# EasyEDA Pro project ProPrj_rp-nano-4_2025-11-21.epro

# Schematic Schematic1
Board Name: Board1; Create Date: 2025-11-17; Page Name: P1; Project Name: rp-nano-4; Schematic Name: Schematic1; Update Date: 2025-11-18; Company: EasyEDA.com; Page Size: A4; Version: V1.0
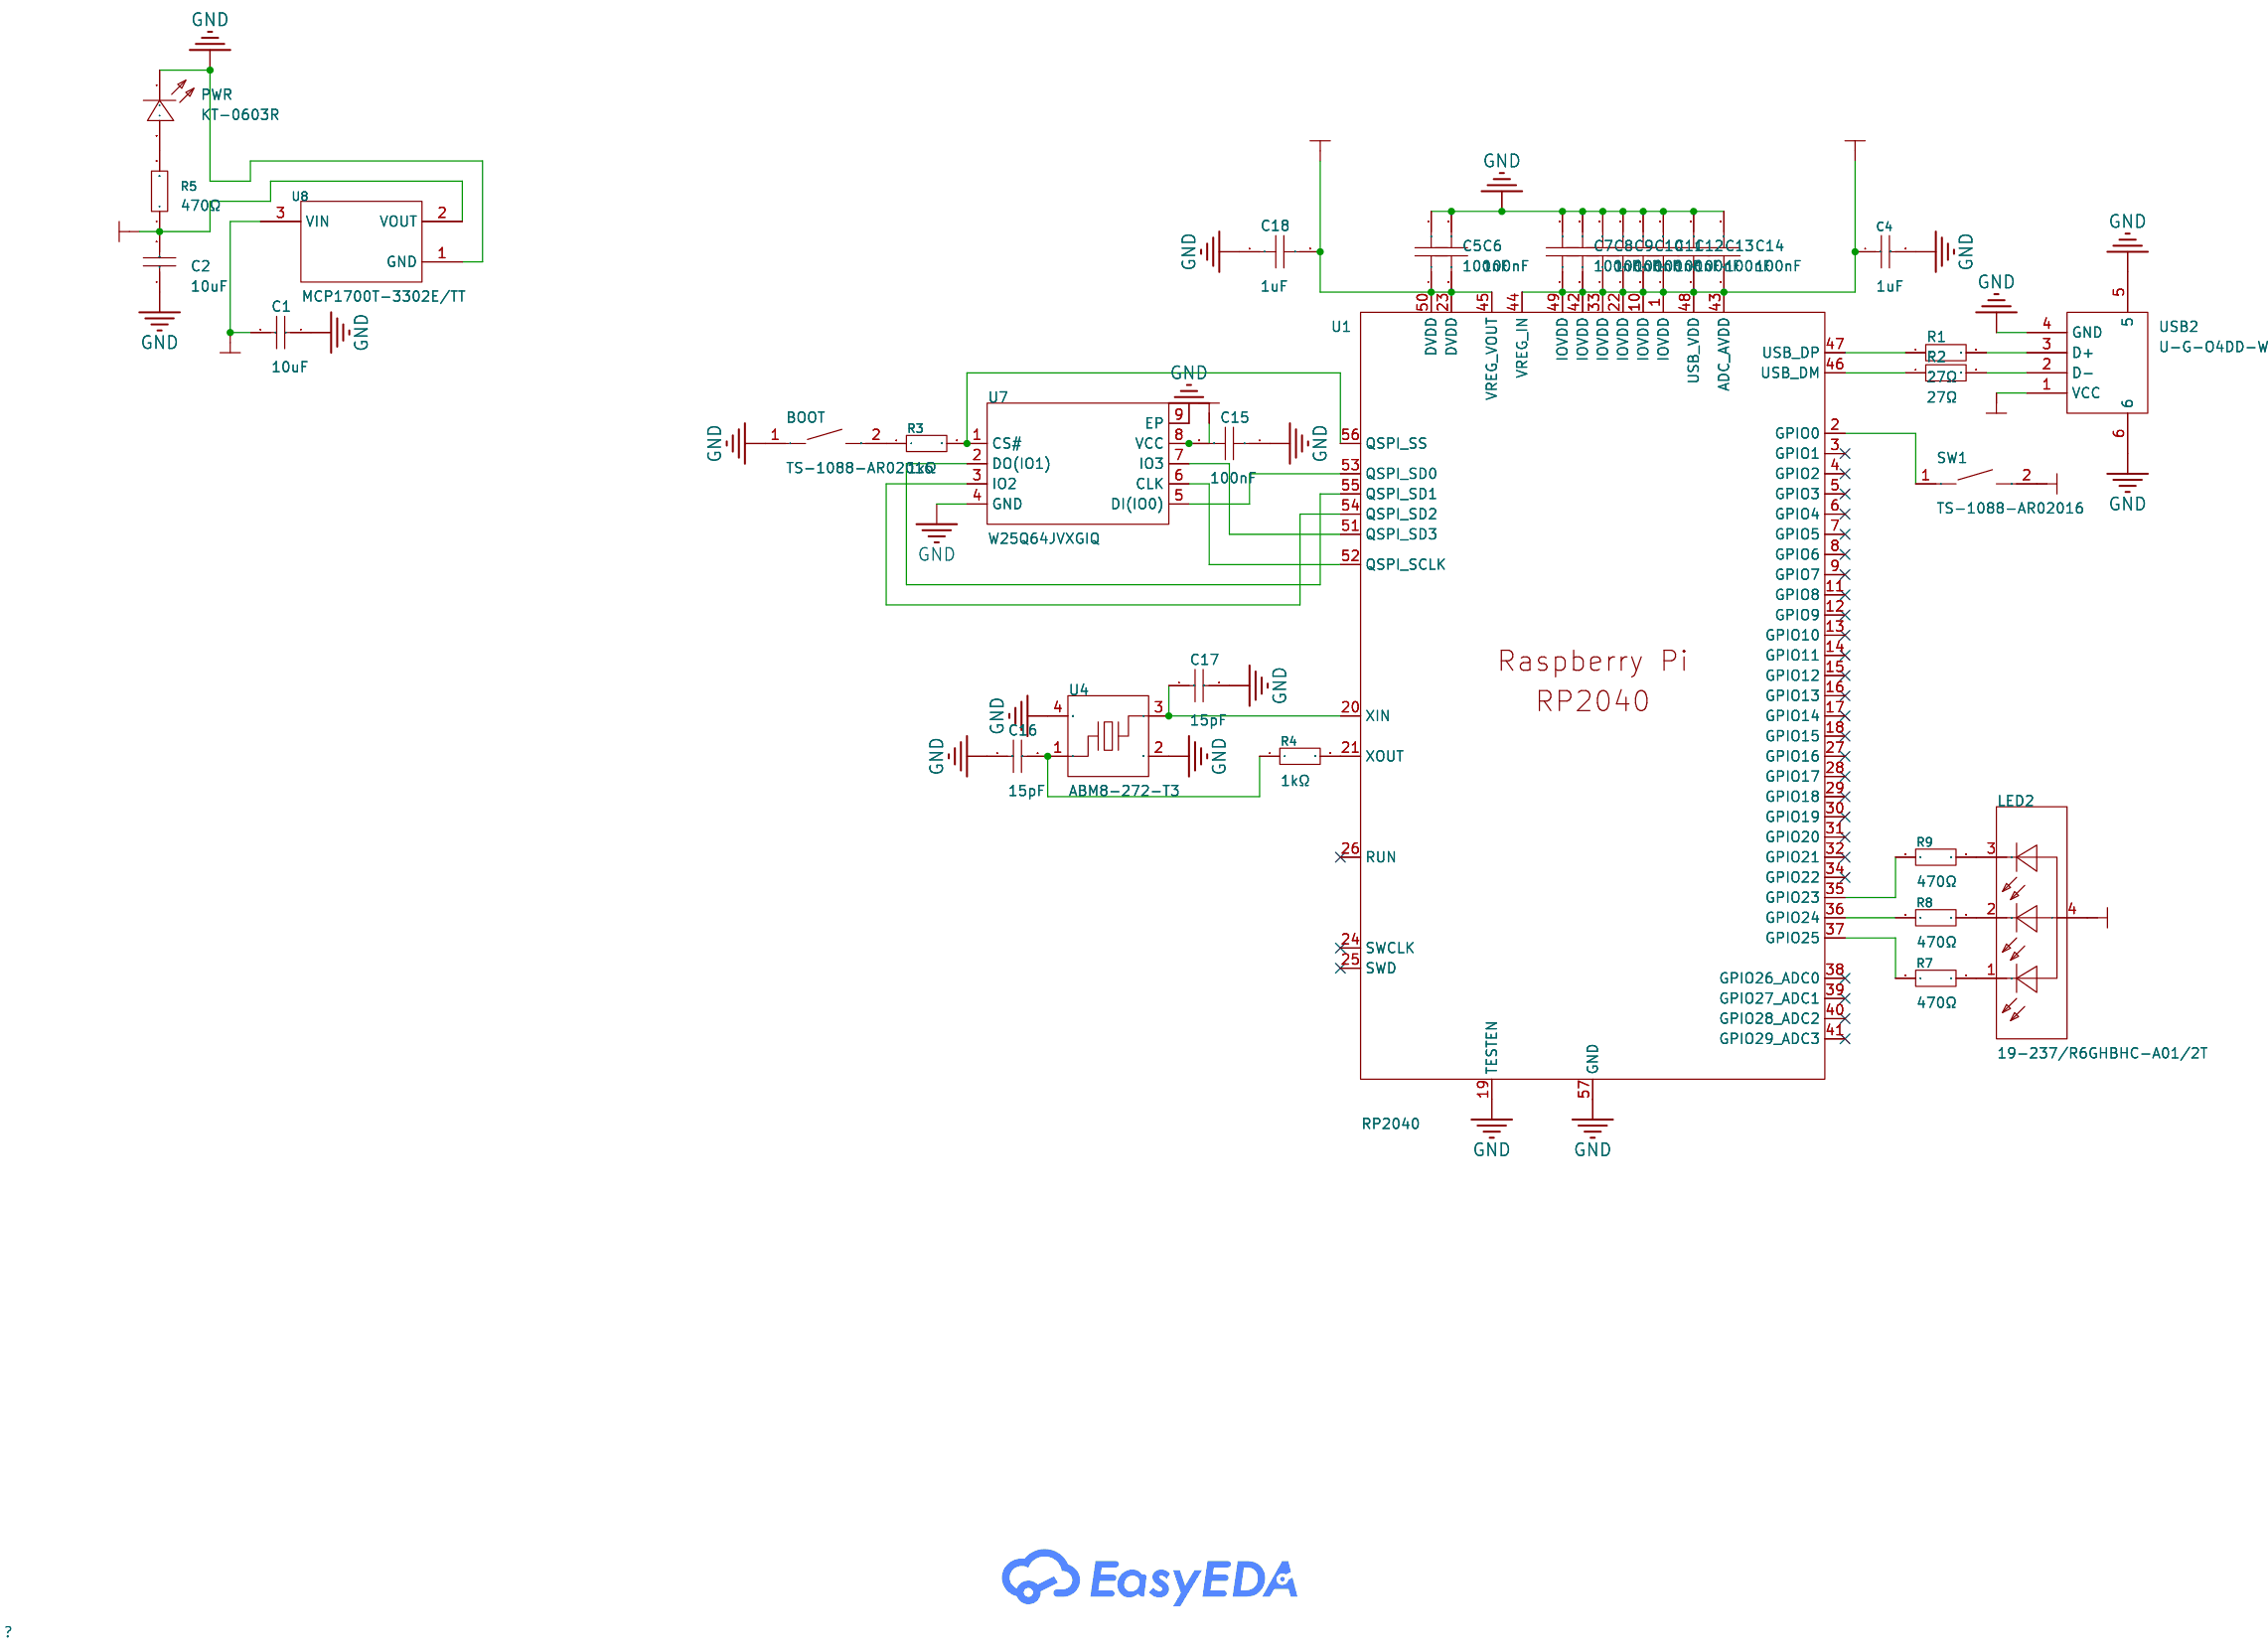
[diagram p0: schematic sheet]

## Parts
BOOT  TS-1088-AR02016  [SW-SMD_L3.9-W3.0-P4.45]
C1  10uF  [C0402]
C2  10uF  [C0402]
C4  1uF  [C0402]
C5  100nF  [C0402]
C6  100nF  [C0402]
C7  100nF  [C0402]
C8  100nF  [C0402]
C9  100nF  [C0402]
C10  100nF  [C0402]
C11  100nF  [C0402]
C12  100nF  [C0402]
C13  100nF  [C0402]
C14  100nF  [C0402]
C15  100nF  [C0402]
C16  15pF  [C0402]
C17  15pF  [C0402]
C18  1uF  [C0402]
LED2  19-237/R6GHBHC-A01/2T  [LED-ARRAY-SMD_4P-L1.6-W1.6-BL_1]
PWR  KT-0603R  [LED0603-RD]
R1  27Ω  [R0402]
R2  27Ω  [R0402]
R3  1kΩ  [R0402]
R4  1kΩ  [R0402]
R5  470Ω  [R0402]
R7  470Ω  [R0402]
R8  470Ω  [R0402]
R9  470Ω  [R0402]
SW1  TS-1088-AR02016  [SW-SMD_L3.9-W3.0-P4.45]
U1  RP2040  [LQFN-56_L7.0-W7.0-P0.4-EP]
U4  ABM8-272-T3  [CRYSTAL-SMD_4P-L3.2-W2.5-BL]
U7  W25Q64JVXGIQ  [XSON-8_L4.0-W4.0-P0.80-TL-EP]
U8  MCP1700T-3302E/TT  [SOT-23-3_L2.9-W1.6-P1.90-LS2.8-BR]
USB2  U-G-O4DD-W-1  [USB-A-TH_U-G-04WD-W-01]

## Library data of the parts
BOOT SW1 = TS-1088-AR02016: Circuit:SPST Actuator Style:Round Button Operating Force:160gf Mounting Style:Brick nogging Switch Length:4mm Switch Width:3mm Switch Height:2mm Strike Gundam:不带 Contact Current:50mA Voltage Rating (DC):12V Insulation Resistance:100MΩ Actuator/Cap Color:B; LCSC Part Name: 4*3*2mm 立贴 轻触开关; Supplier Part: C720477; Manufacturer: XUNPU(讯普); Supplier Footprint: SMD; JLCPCB Part Class: Basic Part; Datasheet: https://atta.szlcsc.com/upload/public/pdf/source/20200810/C720475_60D09DD6C54279ADDB2DC25100F1CC11.pdf; Supplier: LCSC; Circuit: SPST; Actuator Style: Round Button; Operating Force: 160gf; Mounting Style: Brick nogging; Switch Length: 4mm; Switch Width: 3mm; Switch Height: 2mm; Strike Gundam: 不带; Contact Current: 50mA; Voltage Rating (DC): 12V; Insulation Resistance: 100MΩ; Actuator/Cap Color: Black; Pin Style: SMDSplicing; Mechanical Life: 10万次; Operating Temperature: -30℃~+80℃
C1 C2 = CL05A106MQ5NUNC: Capacitance: Tolerance:±20% Tolerance:±20% Voltage Rated: Temperature Coefficient:; LCSC Part Name: 10uF ±20% 6.3V; Supplier Part: C15525; Manufacturer: SAMSUNG(三星); Supplier Footprint: 0402; JLCPCB Part Class: Basic Part; Datasheet: https://atta.szlcsc.com/upload/public/pdf/source/20220823/2B02EE04F8F211D38A52DCB16EB6BEBA.pdf; Supplier: LCSC; Tolerance: ±20%
C4 = CL05A105KO5NNNC: Capacitance: Tolerance:±10% Tolerance:±10% Voltage Rated: Temperature Coefficient:; LCSC Part Name: 1uF ±10% 16V; Supplier Part: C29266; Manufacturer: SAMSUNG(三星); Supplier Footprint: 0402; JLCPCB Part Class: Extended Part; Datasheet: https://atta.szlcsc.com/upload/public/pdf/source/20160218/1457707763339.pdf; Supplier: LCSC; Tolerance: ±10%
C5-C15 = CL05B104KO5NNNC: Capacitance: Tolerance:±10% Tolerance:±10% Voltage Rated: Temperature Coefficient:; LCSC Part Name: 100nF ±10% 16V; Supplier Part: C1525; Manufacturer: SAMSUNG(三星); Supplier Footprint: 0402; JLCPCB Part Class: Basic Part; Datasheet: https://atta.szlcsc.com/upload/public/pdf/source/20160218/1457707763339.pdf; Supplier: LCSC; Tolerance: ±10%
C16 C17 = 0402CG150J500NT: Capacitance: Tolerance:±5% Tolerance:±5% Voltage Rated: Temperature Coefficient:; LCSC Part Name: 15pF ±5% 50V; Supplier Part: C1548; Manufacturer: FH(风华); Supplier Footprint: 0402; JLCPCB Part Class: Basic Part; Datasheet: https://atta.szlcsc.com/upload/public/pdf/source/20200305/C486355_26A10D38EF8C2A5C37091D0039909270.pdf; Supplier: LCSC; Tolerance: ±5%
C18 = CL05A105KA5NQNC: Capacitance: Tolerance:±10% Tolerance:±10% Voltage Rated: Temperature Coefficient:; LCSC Part Name: 1uF ±10% 25V; Supplier Part: C52923; Manufacturer: SAMSUNG(三星); Supplier Footprint: 0402; JLCPCB Part Class: Basic Part; Datasheet: https://atta.szlcsc.com/upload/public/pdf/source/20160218/1457707763339.pdf; Supplier: LCSC; Tolerance: ±10%
LED2 = 19-237/R6GHBHC-A01/2T: Diode Configuration:Common Anode Viewing Angle:120° Lens Color:-; Supplier Part: C60105; Manufacturer: EVERLIGHT(亿光); Supplier Footprint: SMD-4P,1.6x1.6mm; JLCPCB Part Class: Extended Part; Supplier: LCSC; Diode Configuration: Common Anode; Viewing Angle: 120°
PWR = KT-0603R: Emitted Color:Red Power Dissipation:- Forward Current:- Dominant Wavelength:- Dominant Wavelength:- Peak Wavelength:- Diode Configuration:- Lens Color:- Color Temperature:- Color Temperature:- Viewing Angle:- Mounting Sytle:- Operating Temperature:-40℃~+8; LCSC Part Name: 0603 红灯 高亮; Supplier Part: C2286; Manufacturer: KENTO; Supplier Footprint: 0603; JLCPCB Part Class: Basic Part; Datasheet: https://atta.szlcsc.com/upload/public/pdf/source/20160616/1466072038404.pdf; Supplier: LCSC; Emitted Color: Red; Operating Temperature: -40℃~+85℃
R1 R2 = 0402WGF270JTCE: Type:Thick Film Resistors Resistance:27Ω Tolerance:±1% Tolerance:±1% Power(Watts): Overload Voltage (Max): Temperature Coefficient:±100ppm/℃ Temperature Coefficient:±100ppm/℃ Operating Temperature Range:-55℃~+155℃ Operating Temperature Range:-55℃~+155℃; LCSC Part Name: 27Ω ±1% 62.5mW 厚膜电阻; Supplier Part: C25100; Manufacturer: UNI-ROYAL(厚声); Supplier Footprint: 0402; JLCPCB Part Class: Extended Part; Datasheet: https://atta.szlcsc.com/upload/public/pdf/source/20200306/C422600_1E6D84923E4A46A82E41ADD87F860B5C.pdf; Supplier: LCSC; Type: Thick Film Resistors; Tolerance: ±1%; Temperature Coefficient: ±100ppm/℃; Operating Temperature Range: -55℃~+155℃
R3 R4 = 0402WGF1001TCE: Type:Thick Film Resistors Resistance:1kΩ Tolerance:±1% Tolerance:±1% Power(Watts): Overload Voltage (Max): Temperature Coefficient:±100ppm/℃ Temperature Coefficient:±100ppm/℃ Operating Temperature Range:-55℃~+155℃ Operating Temperature Range:-55℃~+155℃; LCSC Part Name: 1kΩ ±1% 62.5mW 厚膜电阻; Supplier Part: C11702; Manufacturer: UNI-ROYAL(厚声); Supplier Footprint: 0402; JLCPCB Part Class: Basic Part; Datasheet: https://atta.szlcsc.com/upload/public/pdf/source/20200306/C422600_1E6D84923E4A46A82E41ADD87F860B5C.pdf; Supplier: LCSC; Type: Thick Film Resistors; Tolerance: ±1%; Temperature Coefficient: ±100ppm/℃; Operating Temperature Range: -55℃~+155℃
R5 R7-R9 = 0402WGF4700TCE: Type:Thick Film Resistors Resistance: Tolerance:±1% Tolerance:±1% Power(Watts): Overload Voltage (Max): Temperature Coefficient:±100ppm/℃ Temperature Coefficient:±100ppm/℃ Operating Temperature Range:-55℃~+155℃ Operating Temperature Range:-55℃~+155℃; LCSC Part Name: 470Ω ±1% 62.5mW 厚膜电阻; Supplier Part: C25117; Manufacturer: UNI-ROYAL(厚声); Supplier Footprint: 0402; JLCPCB Part Class: Basic Part; Datasheet: https://atta.szlcsc.com/upload/public/pdf/source/20200306/C422600_1E6D84923E4A46A82E41ADD87F860B5C.pdf; Supplier: LCSC; Type: Thick Film Resistors; Tolerance: ±1%; Temperature Coefficient: ±100ppm/℃; Operating Temperature Range: -55℃~+155℃
U1 = RP2040_C2040: CPU Core:- CPU Maximum Speed:133MHz Number of I/O:30 ADC (Bit):12bit Applications:-; LCSC Part Name: RP2040（RP2B2）; Supplier Part: C2040; Manufacturer: Raspberry Pi(树莓派); Supplier Footprint: LQFN-56(7x7); JLCPCB Part Class: Extended Part; Datasheet: https://atta.szlcsc.com/upload/public/pdf/source/20210621/C2040_96F425825606B7957D87DD32E2512CA9.pdf; Supplier: LCSC; CPU Maximum Speed: 133MHz; Number of I/O: 30; ADC (Bit): 12bit
U4 = ABM8-272-T3_C20625731: Supplier Part: C20625731; Manufacturer: ABRACON; Supplier Footprint: SMD3225-4P; JLCPCB Part Class: Extended Part; Datasheet: https://atta.szlcsc.com/upload/public/pdf/source/20240227/A8BE43F636D80F75C9AF5C59EDF21E9A.pdf; Supplier: LCSC
U7 = W25Q64JVXGIQ: Interface:SPI Memory Size:64Mbit Clock Frequency:133MHz Voltage - Supply:2.7V~3.6V Voltage - Supply:2.7V~3.6V Program / Erase Cycles:100,000 Cycles Page Programming Time (Tpp):3ms Data Retention - TDR (Year):20 Years; LCSC Part Name: 支持双线、四线SPI接口的3V 64Mbit 串行闪存; Supplier Part: C2940195; Manufacturer: Winbond(华邦); Supplier Footprint: XSON-8-EP(4x4); JLCPCB Part Class: Extended Part; Datasheet: https://item.szlcsc.com/datasheet/W25Q64JVXGIQ/3303811.html; Supplier: LCSC; Interface: SPI; Memory Size: 64Mbit; Clock Frequency: 133MHz; Voltage - Supply: 2.7V~3.6V; Program / Erase Cycles: 100,000 Cycles; Page Programming Time (Tpp): 3ms; Data Retention - TDR (Year): 20 Years
U8 = MCP1700T-3302E/TT: Output Type:Fixed Voltage - Supply:6V Output Voltage:3.3V Output Voltage:3.3V Output Current:250mA Power Supply Rejection Ratio (PSRR):44dB@(100Hz) Voltage Dropout:178mV@(250mA) standby current:1.6uA Features:Short Circuit Protection；Over Temperature Prot; LCSC Part Name: 输入6V 输出3.3V 250mA; Supplier Part: C39051; Manufacturer: MICROCHIP(美国微芯); Supplier Footprint: SOT-23; JLCPCB Part Class: Extended Part; Datasheet: https://item.szlcsc.com/datasheet/MCP1700T-3302E%252FTT/40034.html; Supplier: LCSC; Output Type: Fixed; Voltage - Supply: 6V; Output Voltage: 3.3V; Output Current: 250mA; Power Supply Rejection Ratio (PSRR): 44dB@(100Hz); Voltage Dropout: 178mV@(250mA); standby current: 1.6uA; Features: Short Circuit Protection；Over Temperature Protection; Operating Temperature: -40℃~+125℃@(Tj); Output Configuration: Positive; Number of Outputs: 1
USB2 = U-G-O4DD-W-1: Connector Type:Type-A Protocol Standard:USB 2.0 Gender:Male Number of Contacts:4P Number of Ports:1 Current Rating-Power:1A; LCSC Part Name: Type-A 公; Supplier Part: C98125; Manufacturer: 韩国韩荣; Supplier Footprint: 插件; JLCPCB Part Class: Extended Part; Datasheet: https://item.szlcsc.com/datasheet/U-G-O4DD-W-1/99334.html; Supplier: LCSC; Connector Type: Type-A; Protocol Standard: USB 2.0; Gender: Male; Number of Contacts: 4P; Number of Ports: 1; Current Rating-Power: 1A

## Nets
GND: BOOT.1 C1.1 C2.1 C4.2 C5.2 C6.2 C7.2 C8.2 C9.2 C10.2 C11.2 C12.2 C13.2 C14.2 C15.1 C16.1 C17.2 C18.1 PWR.1(K) U1.19(TESTEN) U1.57(GND) U4.2(GND) U4.4(GND) U7.4(GND) U7.9(EP) U8.1(GND) USB2.4(GND) USB2.5 USB2.6
VCC_1V1: C5.1 C6.1 C18.2 U1.23(DVDD) U1.45(VREG_VOUT) U1.50(DVDD)
VCC_3V3: C2.2 C4.1 C7.1 C8.1 C9.1 C10.1 C11.1 C12.1 C13.1 C14.1 C15.2 LED2.4(+) R5.1 SW1.2 U1.1(IOVDD) U1.10(IOVDD) U1.22(IOVDD) U1.33(IOVDD) U1.42(IOVDD) U1.43(ADC_AVDD) U1.44(VREG_IN) U1.48(USB_VDD) U1.49(IOVDD) U7.8(VCC) U8.2(VOUT)
VCC_5V: C1.2 U8.3(VIN) USB2.1(VCC)
$1N804: R1.2 USB2.3(D+)
$1N806: R2.2 USB2.2(D-)
$1N1544: R1.1 U1.47(USB_DP)
$1N1583: R2.1 U1.46(USB_DM)
$1N2452: R3.2 U1.56(QSPI_SS) U7.1(CS#)
$1N2596: U1.53(QSPI_SD0) U7.5(DI(IO0))
$1N2608: U1.51(QSPI_SD3) U7.7(IO3)
$1N2622: U1.54(QSPI_SD2) U7.3(IO2)
$1N3571: C16.2 R4.1 U4.1
$1N3577: C17.1 U1.20(XIN) U4.3
$1N6628: SW1.1 U1.2(GPIO0)
$1N11236: PWR.2(A) R5.2
$1N11428: R4.2 U1.21(XOUT)
$1N11791: BOOT.2 R3.1
$1N11907: U1.55(QSPI_SD1) U7.2(DO(IO1))
$1N11923: U1.52(QSPI_SCLK) U7.6(CLK)
$1N13985: LED2.1(R-) R7.1
$1N14024: LED2.2(G-) R8.1
$1N14063: LED2.3(B-) R9.1
$1N14067: R8.2 U1.36(GPIO24)
$1N14071: R7.2 U1.37(GPIO25)
$1N14077: R9.2 U1.35(GPIO23)

Not connected (* = marked no-connect by the designer): U1 3(GPIO1)* 4(GPIO2)* 5(GPIO3)* 6(GPIO4)* 7(GPIO5)* 8(GPIO6)* 9(GPIO7)* 11(GPIO8)* 12(GPIO9)* 13(GPIO10)* 14(GPIO11)* 15(GPIO12)* 16(GPIO13)* 17(GPIO14)* 18(GPIO15)* 24(SWCLK)* 25(SWD)* 26(RUN)* 27(GPIO16)* 28(GPIO17)* 29(GPIO18)* 30(GPIO19)* 31(GPIO20)* 32(GPIO21)* 34(GPIO22)* 38(GPIO26_ADC0)* 39(GPIO27_ADC1)* 40(GPIO28_ADC2)* 41(GPIO29_ADC3)*

# Board PCB1
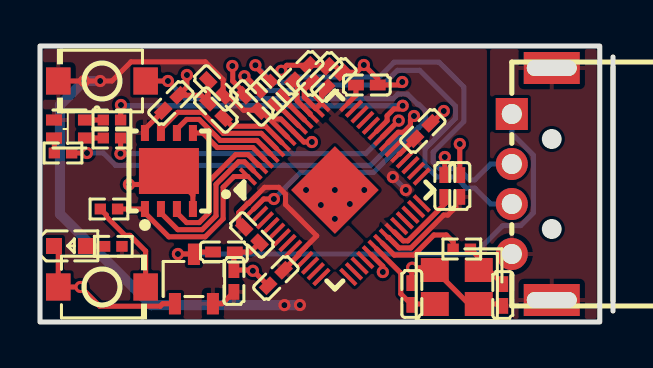
[diagram p1: board, top side]
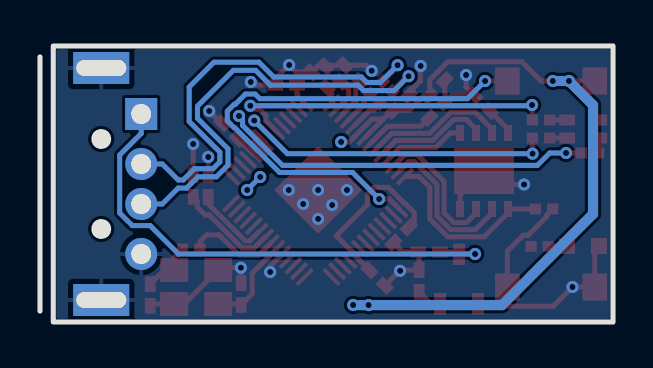
[diagram p2: board, bottom side, seen from below]

Outline 28.66 x 13.8 mm; copper layers: Top Layer, Bottom Layer. Coordinates in mm from the lower left corner of the outline.
Outline path: rectangle 0,13.8 28,0
Stack: Top Layer 0.035mm / Dielectric1 1.51mm FR4 er 4.5 / Bottom Layer 0.035mm

## Design rules (mm)
net $1N806: DP1
net $1N804: DP1
net $1N1583: DP2
net $1N1544: DP2
net $1N3577: DP3
net $1N11428: DP3
template: Custom Config
spacing copperThickness1oz (default): track to track 0.102, other pairs 0.152 to 0.3
spacing copperThickness2oz: track to track 0.203, other pairs 0.152 to 0.3
track width copperThickness1oz (default): min 0.127, default 0.254, max 2.54
track width copperThickness2oz: min 0.6, default 0.75, max 0.9
differential pair differentialPair (default): width min 0.127, default 0.254, max 2.54; gap min 0.152, default 0.152
via viaSize (default): diameter min 0.5, default 0.61, max 10; hole min 0.3, default 0.305, max 6.3

## Placement (name value [footprint] x y rotation side)
BOOT  TS-1088-AR02016  [SW-SMD_L3.9-W3.0-P4.45]  3.1 1.75 0 top
C1  10uF  [C0402]  9.2 3.5 180 top
C2  10uF  [C0402]  9.7 2.05 270 top
C4  1uF  [C0402]  16.35 11.85 0 top
C5  100nF  [C0402]  8.8 10.6 135 top
C6  100nF  [C0402]  20.25 6.8 90 top
C7  100nF  [C0402]  8.8 11.7 135 top
C8  100nF  [C0402]  14 12.4 45 top
C9  100nF  [C0402]  19.15 9.55 45 top
C10  100nF  [C0402]  21 6.8 90 top
C11  100nF  [C0402]  11.8 2.2 225 top
C12  100nF  [C0402]  10.6 4.35 315 top
C13  100nF  [C0402]  10.6 10.95 135 top
C14  100nF  [C0402]  14.7 12.1 45 top
C15  100nF  [C0402]  6.55 10.95 225 top
C16  15pF  [C0402]  23.15 1.35 90 top
C17  15pF  [C0402]  18.6 1.4 90 top
C18  1uF  [C0402]  13.05 12.45 225 top
LED2  19-237/R6GHBHC-A01/2T  [LED-ARRAY-SMD_4P-L1.6-W1.6-BL_1]  1.5 9.65 180 top
PWR  KT-0603R  [LED0603-RD]  1.5 3.8 0 top
R1  27Ω  [R0402]  11.35 11.22 135 top
R2  27Ω  [R0402]  11.84 11.72 135 top
R3  1kΩ  [R0402]  3.45 5.65 0 top
R4  1kΩ  [R0402]  21.1 3.65 180 top
R5  470Ω  [R0402]  3.67 3.78 180 top
R7  470Ω  [R0402]  3.6 10.1 0 top
R8  470Ω  [R0402]  3.6 9.2 0 top
R9  470Ω  [R0402]  1.15 8.45 0 top
SW1  TS-1088-AR02016  [SW-SMD_L3.9-W3.0-P4.45]  3.1 12.05 180 top
U1  RP2040  [LQFN-56_L7.0-W7.0-P0.4-EP]  14.75 6.6 45 top
U4  ABM8-272-T3  [CRYSTAL-SMD_4P-L3.2-W2.5-BL]  20.85 1.75 180 top
U7  W25Q64JVXGIQ  [XSON-8_L4.0-W4.0-P0.80-TL-EP]  6.45 7.55 90 top
U8  MCP1700T-3302E/TT  [SOT-23-3_L2.9-W1.6-P1.90-LS2.8-BR]  7.7 2.15 270 top
USB2  U-G-O4DD-W-1  [USB-A-TH_U-G-04WD-W-01]  24.6 6.9 90 top

## Footprints (pads in the part's own frame, mm; a bottom-side part is the same pattern mirrored in y, then rotated)
C0402
  rect 0.79x0.54 smd: 1(-0.545,0) 2(0.545,0)
CRYSTAL-SMD_4P-L3.2-W2.5-BL
  rect 1.4x1.2 smd: 1(-1.1,-0.85) 2(1.1,-0.85) 3(1.1,0.85) 4(-1.1,0.85)
LED0603-RD
  rect 0.8x0.8 smd: 1(-0.799,0) 2(0.799,0)
LED-ARRAY-SMD_4P-L1.6-W1.6-BL_1
  rect 0.8x0.55 smd: 1(-0.8,-0.45) 2(-0.8,0.45) 3(0.8,0.45) 4(0.8,-0.45)
LQFN-56_L7.0-W7.0-P0.4-EP
  rect 1.1x0.2 smd: 1(-3.55,2.6) 2(-3.55,2.2) 3(-3.55,1.8) 4(-3.55,1.4) 5(-3.55,1) 6(-3.55,0.6) 7(-3.55,0.2) 8(-3.55,-0.2) 9(-3.55,-0.6) 10(-3.55,-1) 11(-3.55,-1.4) 12(-3.55,-1.8) 13(-3.55,-2.2) 14(-3.55,-2.6) 29(3.55,-2.6) 30(3.55,-2.2) 31(3.55,-1.8) 32(3.55,-1.4) 33(3.55,-1) 34(3.55,-0.6) 35(3.55,-0.2) 36(3.55,0.2) 37(3.55,0.6) 38(3.55,1) 39(3.55,1.4) 40(3.55,1.8) 41(3.55,2.2) 42(3.55,2.6)
  rect 0.2x1.1 smd: 15(-2.6,-3.55) 16(-2.2,-3.55) 17(-1.8,-3.55) 18(-1.4,-3.55) 19(-1,-3.55) 20(-0.6,-3.55) 21(-0.2,-3.55) 22(0.2,-3.55) 23(0.6,-3.55) 24(1,-3.55) 25(1.4,-3.55) 26(1.8,-3.55) 27(2.2,-3.55) 28(2.6,-3.55) 43(2.6,3.55) 44(2.2,3.55) 45(1.8,3.55) 46(1.4,3.55) 47(1,3.55) 48(0.6,3.55) 49(0.2,3.55) 50(-0.2,3.55) 51(-0.6,3.55) 52(-1,3.55) 53(-1.4,3.55) 54(-1.8,3.55) 55(-2.2,3.55) 56(-2.6,3.55)
  rect 3.1x3.1 smd: 57(0,0)
R0402
  rect 0.566x0.54 smd: 1(-0.433,0) 2(0.433,0)
SOT-23-3_L2.9-W1.6-P1.90-LS2.8-BR
  rect 1.07x0.6 smd: 1(1.235,-0.95) 2(1.235,0.95) 3(-1.235,0)
SW-SMD_L3.9-W3.0-P4.45
  rect 1.23x1.36 smd: 1(-2.185,0) 2(2.185,0)
USB-A-TH_U-G-04WD-W-01
  rect 1.6x1.6 hole 1: 1(3.5,1)
  round 1.6 hole 1: 2(1,1) 3(-1,1) 4(-3.5,1)
  rect 1.6x2.8 hole 0.8x2.5: 5(5.8,-1) 6(-5.8,-1)
XSON-8_L4.0-W4.0-P0.80-TL-EP
  rect 0.8x0.4 smd: 1(-1.9,1.2) 2(-1.9,0.4) 3(-1.9,-0.4) 4(-1.9,-1.2) 5(1.9,-1.2) 6(1.9,-0.4) 7(1.9,0.4) 8(1.9,1.2)
  rect 2.3x3 smd: 9(0,0)

## Nets
As in the schematic.

Pads without a net: U1 3 4 5 6 7 8 9 11 12 13 14 15 16 17 18 24 25 26 27 28 29 30 31 32 34 38 39 40 41

## Via types
v1: diameter 0.61, hole 0.305, Top Layer to Bottom Layer, 37 vias

## Routing (per net, layer and track width the routed paths; a pad name or vN(x,y) marks a point on that pad's centre or on a via; arc(x,y) is an arc through that point)
GND: length 40.8
  Top Layer w0.254: v1(12.07,12.56) 12.35,12.84 C18.1 14.34,12.84 C8.2 14.79,12.79 C14.2 15.84,12.49 v1(16.2,12.85) 16.89,12.16 C4.2 17.97,11.85 v1(18.12,12) ; U1.19 17.15,2.79 v1(17.15,2.5) ; v1(21,8.9) 21,7.34 ; v1(20.2,10.55) 19.59,9.94 C9.2 ; C12.2 10.52,3.5 9.75,3.5 9.7,3.46 C2.1 10.61,2.59 v1(10.65,2.56) 10.67,2.56 C11.2 ; C16.1 23.06,0.9 U4.4 21.45,0.9 U4.2 19.64,2.71 v1(18.61,2.71) 18.6,2.7 C17.2 ; v1(9.62,12.8) 9.64,12.78 9.64,12.05 10.21,11.48 C13.2 ; v1(20.25,8.25) 20.25,7.34 ; C7.2 C5.2 8.06,11.34 C15.1 7.35,11.75 v1(7.35,12.35) ; U7.4 7.65,6.35 U7.9 5.78,6.88 v1(4.45,6.88) ; PWR.1 0.91,3.59 BOOT.1 v1(2.03,1.75) 2.99,0.79 6.02,0.79 6.14,0.92 U8.1
  vias: v1(13.31,6.6) v1(14.05,5.85) v1(14.75,6.6) v1(14.75,5.16) v1(15.5,5.9) v1(16.22,6.6)
VCC_1V1: length 9.3
  Top Layer w0.254: U1.45 13.51,10.41 12.87,11.06 12.87,11.86 C18.2 ; C6.1 20.25,5.91 18.4,4.06 18.17,4.06 17.71,4.51 ; U1.50 11.28,9.79 9.61,9.79 C5.1
VCC_3V3: length 61.1
  Top Layer w0.254: U1.42 15.81,11.33 C4.1 ; C12.1 10.16,4.74 9.95,4.95 9.95,5.47 U1.1 10.43,5.93 11.24,6.73 11.94,6.73 12.28,6.39 12.28,5.87 13.84,4.31 12.95,3.41 U1.10 12.95,3.35 12.49,2.9 12.49,2.89 C11.1 ; 5.25,9.64 6.16,10.56 C15.2 ; U1.49 11.48,10.15 ; 11.48,10.15 11.07,10.56 C13.1 10.96,10.59 10.19,10.59 9.46,11.31 C7.1 9.16,11.34 9.16,12.11 8.27,13.01 4.55,13.01 3.6,12.05 v1(3.01,12.05) v1(2.2,12.05) SW1.2 ; 11.48,10.15 12.05,10.15 U1.48 13.2,9 v1(13.6,9) ; U1.22 17.43,4.23 17.96,3.7 18.55,3.7 20.19,5.35 20.4,5.35 20.8,5.74 20.8,6.05 C10.1 ; C8.1 13.22,11.62 13.22,11.24 U1.44 U1.43 14.08,11.48 C14.1 ; U8.2 9.11,0.92 C2.2 ; C9.1 18.46,8.86 18.45,8.86 18,8.4 U1.33
  Bottom Layer w0.254: v1(18.3,6.6) v1(17.65,7.25)
  Bottom Layer w0.508: v1(3.01,12.05) v1(2.2,12.05) 1,10.85 1,5.4 5.56,0.84 v1(12.23,0.84) 12.99,0.84 v1(13,0.85)
VCC_5V: length 25.8
  Top Layer w0.254: v1(6.9,3.4) 7.69,3.4 U8.3 7.81,3.5 C1.2
  Bottom Layer w0.254: USB2.1 23.6,9.43 24.68,8.35 24.68,5.45 24.05,4.82 23.15,4.82 21.73,3.4 v1(6.9,3.4)
$1N804: length 21.9
  Top Layer w0.254: v1(10.23,12.29) 10.28,12.29 R1.2
  Bottom Layer w0.254: USB2.3 22.55,5.9 21.75,6.7 21.33,6.7 20.76,7.26 19.84,7.26 19.26,7.84 19.26,8.66 20.78,10.18 20.78,10.79 18.99,12.58 17.88,12.58 17.14,11.84 12.76,11.84 12.48,11.57 10.95,11.57 v1(10.23,12.29)
$1N806: length 21.9
  Top Layer w0.254: v1(10.78,12.84) 10.78,12.78 11.53,12.03
  Bottom Layer w0.254: USB2.2 22.55,7.9 21.75,7.1 21.5,7.1 20.93,7.67 20.01,7.67 19.67,8.01 19.67,8.49 21.2,10.03 21.2,11.75 19.96,12.99 17.71,12.99 16.97,12.25 12.59,12.25 12.31,11.98 11.64,11.98 v1(10.78,12.84)
$1N1544: length 1.7
  Top Layer w0.254: 12.94,9.81 12.16,10.6 11.95,10.6 11.66,10.9
$1N1583: length 1.7
  Top Layer w0.254: 12.15,11.39 12.45,11.09 12.45,10.88 U1.46
$1N2452: length 9.2
  Top Layer w0.254: R3.2 U7.1 ; U1.56 9.7,7.27 9.16,6.74 9.16,5.16 8.26,4.26 6.45,4.26 5.25,5.46
$1N2596: length 4.2
  Top Layer w0.254: U1.53 10.65,8.72 8.87,8.72 8.14,9.45 U7.5
$1N2608: length 7.1
  Top Layer w0.254: U1.51 11.07,9.43 9.16,9.43 8.11,10.48 6.89,10.48 6.05,9.64 U7.7
$1N2622: length 7.1
  Top Layer w0.254: U7.3 6.85,5.46 7.33,4.97 7.97,4.97 8.45,5.46 8.45,7.03 9.79,8.37 10.41,8.37 10.94,7.84 U1.54
$1N3571: length 2.7
  Top Layer w0.254: C16.2 22.44,2.6 U4.1 21.95,3.23 R4.1
$1N3577: length 4.7
  Top Layer w0.254: U4.3 18.64,0.9 C17.1 18.05,1.41 18.05,2.44 16.83,3.66
$1N6628: length 25.7
  Top Layer w0.254: U1.2 11.19,6.15 v1(11.7,6.15) ; v1(6.4,12.05) SW1.1
  Bottom Layer w0.254: v1(6.4,12.05) 7.28,11.17 17.67,11.17 17.9,11.4 18.38,11.4 18.9,10.88 18.95,10.88 19.29,10.54 19.29,10.06 18.95,9.72 18.92,9.72 16.68,7.48 13.03,7.48 v1(11.7,6.15)
$1N11236: length 0.9
  Top Layer w0.254: R5.2 3.22,3.8 PWR.2
$1N11428: length 4.7
  Top Layer w0.254: R4.2 20.67,4.01 20.33,4.35 19.7,4.35 18.7,3.35 17.72,3.35 U1.21
$1N11791: length 5
  Top Layer w0.254: R3.1 3.32,5.35 3.32,5.26 4.25,4.33 4.5,4.33 5.28,3.55 BOOT.2
$1N11907: length 7.7
  Top Layer w0.254: U1.55 10.23,8.01 9.93,8.01 8.81,6.88 8.81,5.31 8.11,4.62 6.89,4.62 6.05,5.46 U7.2
$1N11923: length 5.8
  Top Layer w0.254: U1.52 10.86,9.08 9.02,9.08 7.97,10.13 7.33,10.13 6.85,9.64 U7.6
$1N13985: length 0.9
  Top Layer w0.254: LED2.1 R7.1
$1N14024: length 0.9
  Top Layer w0.254: LED2.2 R8.1
$1N14063: length 0.8
  Top Layer w0.254: R9.1 0.72,9.18 LED2.3
$1N14067: length 16.6
  Top Layer w0.254: v1(17.95,10.07) 17.94,10.07 U1.36 ; R8.2 4.03,8.42 v1(4.03,8.42)
  Bottom Layer w0.254: v1(17.95,10.07) 16.29,8.42 v1(4.03,8.42)
$1N14071: length 16.8
  Top Layer w0.254: v1(18.14,10.81) 18.11,10.81 17.96,10.66 17.7,10.66 17.36,10.31 17.36,10.06 U1.37 ; v1(4.05,10.85) 4.03,10.83 R7.2
  Bottom Layer w0.254: v1(4.05,10.85) 4.09,10.81 v1(18.14,10.81)
$1N14077: length 20.6
  Top Layer w0.254: R9.2 v1(2.35,8.45) ; v1(18.71,10.3) 18.71,10.28 18.53,10.1 18.53,9.83 18.19,9.49 17.92,9.49 U1.35
  Bottom Layer w0.254: v1(18.71,10.3) 18.53,10.12 18.53,9.83 16.53,7.83 3.78,7.83 3.16,8.45 v1(2.35,8.45)

## Copper pours and planes (outline as drawn; the poured copper is in the pictures)
GND on Top Layer: 22.35,13.8 28.65,13.8 28.65,0 22.35,0
GND on Bottom Layer: 0,13.8 28.65,13.8 28.65,0 0,0
VCC_1V1 on Top Layer: 16.8,3.7 12.03,8.47 13.93,10.38 18.71,5.61
VCC_3V3 on Top Layer: 0,13.8 22.36,13.8 22.36,0 0,0
